# Altium schematic sheet MAX2620.SchDoc
size A2
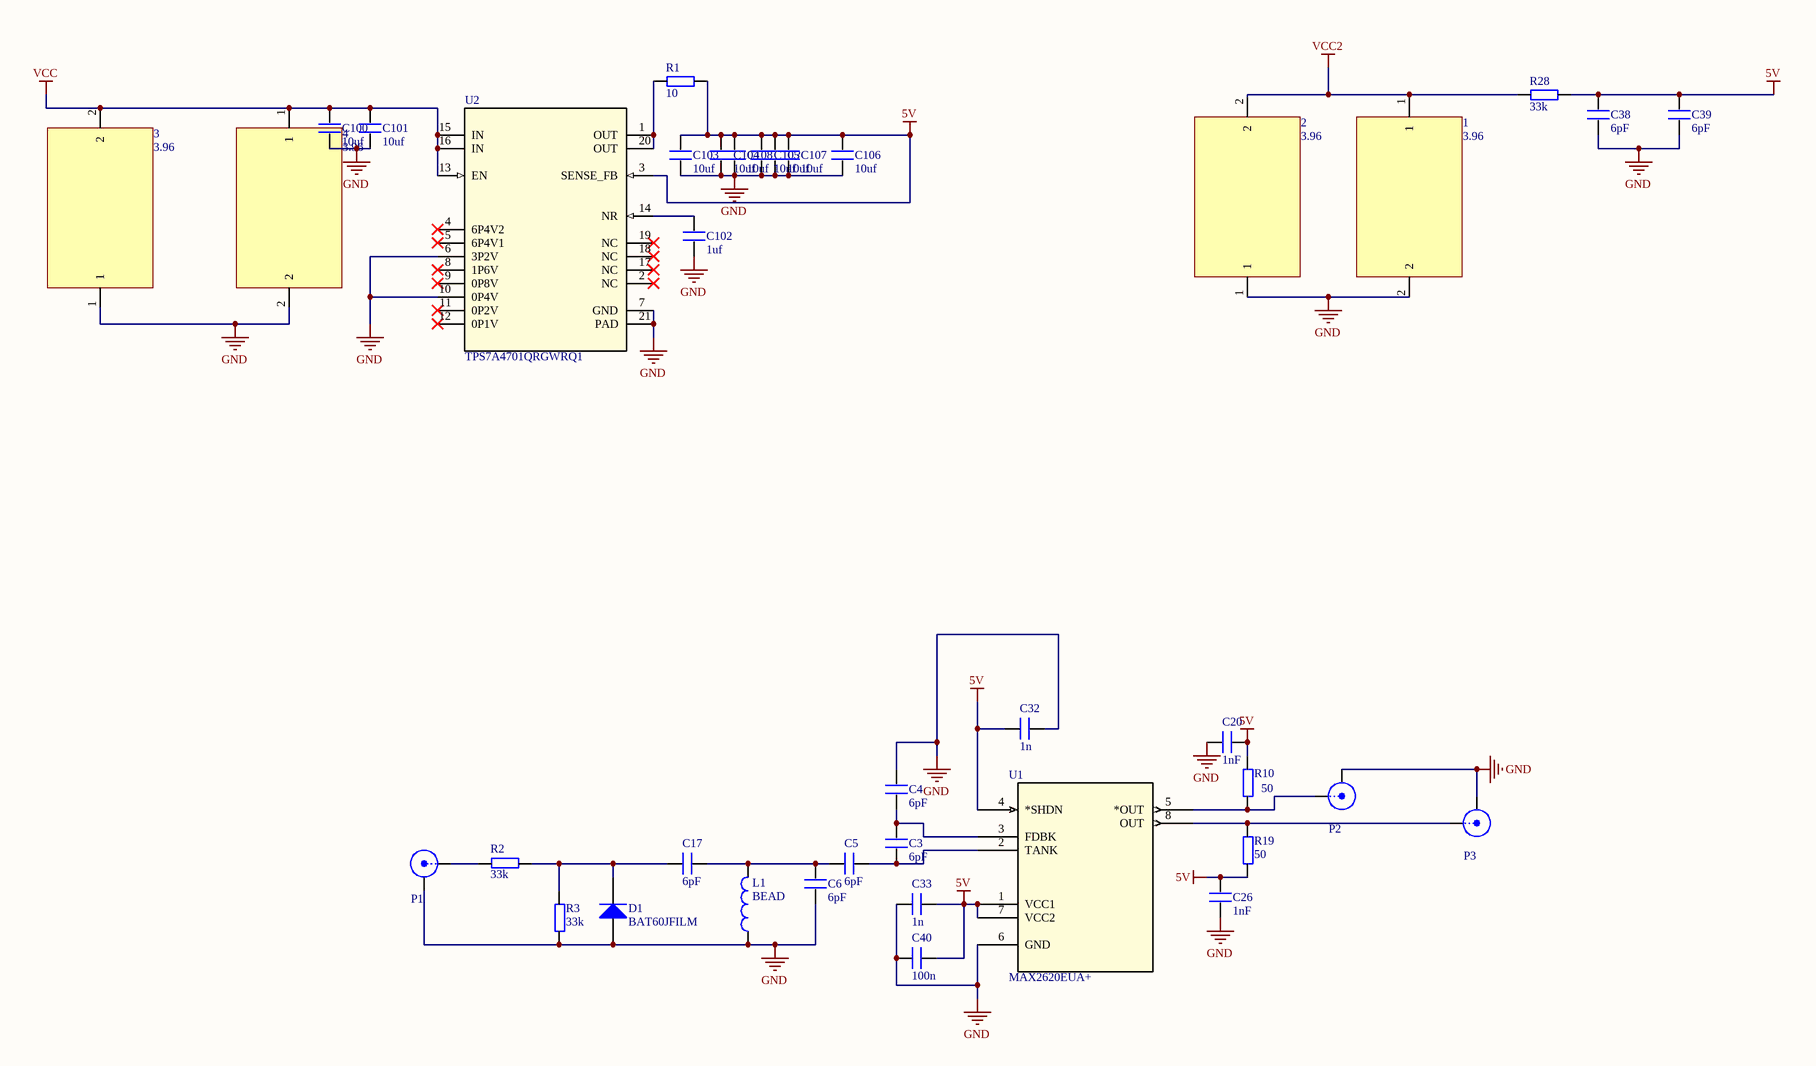
[diagram p0: MAX2620.SchDoc]

## Parts
1  3.96  [3.96]
2  3.96  [3.96]
3  3.96  [3.96]
4  3.96  [3.96]
C3  6pF  [0402]
C4  6pF  [0402]
C5  6pF  [0402]
C6  6pF  [0402]
C17  6pF  [0402]
C20  1nF  [0402]
C26  1nF  [0402]
C32  1n  [0402]
C33  1n  [0402]
C38  6pF  [0402]
C39  6pF  [0402]
C40  100n  [0402]
C100  10uf  [0603C]
C101  10uf  [0603C]
C102  1uf  [0402]
C103  10uf  [0603C]
C104  10uf  [0603C]
C105  10uf  [0603C]
C106  10uf  [0603C]
C107  10uf  [0603C]
C108  10uf  [0603C]
C?  10uf  [0603C]
D1  BAT60JFILM  [SOD-323]
L1  BEAD  [0603L]
P1  SMA  [SMA]  (value not drawn)
P2  SMA  [SMA]  (value not drawn)
P3  SMA  [SMA]  (value not drawn)
R1  10  [0603R]
R2  33k  [0402]
R3  33k  [0402]
R10  50  [0603R]
R19  50  [0603R]
R28  33k  [0603R]
U1  MAX2620EUA+  [21-0036K_MXM]
U2  TPS7A4701QRGWRQ1  [RGW0020A]

## Nets
5V: C20.1 C26.2 C32.1 C33.2 C38.2 C39.2 C40.2 C103.2 C104.2 C105.2 C106.2 C107.2 C108.2 C?.2 R1.2 R10.2 R19.1 R28.2 U1.1(VCC1) U1.4(*SHDN) U1.7(VCC2) U2.3(SENSE_FB)
GND: 1.2 2.1 3.1 4.2 C4.2 C6.1 C20.2 C26.1 C32.2 C33.1 C38.1 C39.1 C40.1 C100.1 C101.1 C102.1 C103.1 C104.1 C105.1 C106.1 C107.1 C108.1 C?.1 D1.1(A) L1.1 P1.2(Y) P2.2(Y) P3.2(Y) R3.1 U1.6(GND) U2.6(3P2V) U2.7(GND) U2.10(0P4V) U2.21(PAD)
VCC: 3.2 4.1 C100.2 C101.2 U2.13(EN) U2.15(IN) U2.16(IN)
VCC2: 1.1 2.2 R28.1
NetC3_1: C3.1 C5.2 U1.2(TANK)
NetC3_2: C3.2 C4.1 U1.3(FDBK)
NetC5_1: C5.1 C6.2 C17.2 L1.2
NetC17_1: C17.1 D1.2(K) R2.1 R3.2
NetC102_2: C102.2 U2.14(NR)
NetP1_1: P1.1(X) R2.2
NetP2_1: P2.1(X) R10.1 U1.5(*OUT)
NetP3_1: P3.1(X) R19.2 U1.8(OUT)
NetR1_1: R1.1 U2.1(OUT) U2.20(OUT)

Not connected (* = marked no-connect by the designer): U2 2(NC)* 4(6P4V2)* 5(6P4V1)* 8(1P6V)* 9(0P8V)* 11(0P2V)* 12(0P1V)* 17(NC)* 18(NC)* 19(NC)*

## Library data of the parts
C3-C6 C17 C20 C26 C32 C33 C38-C40 C100-C108 C? = C: Capacitor
D1 = Diode: Default Diode; Code - JEDEC: DO-214-AB; Ordered by: STM; ECCN_US/EU: EAR99/NEC; Published: 8-Jun-2000; Revision: July-2002: Re-released for DXP Platform.; Publisher: Altium Limited
L1 = Inductor: Value: 100uH; Published: 8-Jun-2000; Revision: July-2002: Re-released for DXP Platform.; Publisher: Altium Limited
P1-P3 = SMA: SMA Connector
R1-R3 R10 R19 R28 = Resistor
U1 = MAX2620EUA+: No Description Available; SourceLibrary: Maxim_2011-10-27; Built_By: EMA_UL_Team; Vendor: Maxim Integrated Products; Revision: 2; Manufacturer_Part_Number: MAX2620EUA+; Copyright: Copyright (C) 2018 Accelerated Designs. All rights reserved; RefDes: RefDes; Type: DEV
U2 = TPS7A4701QRGWRQ1: No Description Available; Manufacturer: Texas Instruments; PartNumber: TPS7A4701QRGWRQ1; RefDes: RefDes; Type: DEV; Value: Value; Copyright: Copyright (C) 2018 Accelerated Designs. All rights reserved